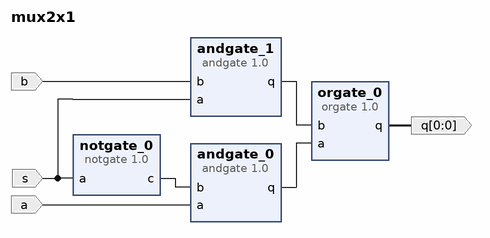
[diagram p0: block diagram of the top level]
# Vivado block design mux2x1, xc7a100tfgg484-1, Vivado 2017.4
create_bd_design mux2x1

create_bd_port -dir I s
create_bd_port -dir I a
create_bd_port -dir I b
create_bd_port -dir O -from 0 -to 0 q

create_bd_cell -type ip -vlnv CSE:CSE:notgate:1.0 notgate_0
set_property -dict {CONFIG.WIDTH 1} [get_bd_cells notgate_0]
create_bd_cell -type ip -vlnv CSE:CSE:orgate:1.0 orgate_0
set_property -dict {CONFIG.WIDTH 1} [get_bd_cells orgate_0]
create_bd_cell -type ip -vlnv CSE:CSE:andgate:1.0 andgate_0
set_property -dict {CONFIG.WIDTH 1} [get_bd_cells andgate_0]
create_bd_cell -type ip -vlnv CSE:CSE:andgate:1.0 andgate_1
set_property -dict {CONFIG.WIDTH 1} [get_bd_cells andgate_1]

# ---- connections ----

connect_bd_net [get_bd_ports s] [get_bd_pins notgate_0/a] [get_bd_pins andgate_1/a]
connect_bd_net [get_bd_pins orgate_0/q] [get_bd_ports q]
connect_bd_net [get_bd_ports a] [get_bd_pins andgate_0/a]
connect_bd_net [get_bd_pins notgate_0/c] [get_bd_pins andgate_0/b]
connect_bd_net [get_bd_ports b] [get_bd_pins andgate_1/b]
connect_bd_net [get_bd_pins andgate_0/q] [get_bd_pins orgate_0/a]
connect_bd_net [get_bd_pins andgate_1/q] [get_bd_pins orgate_0/b]

validate_bd_design
save_bd_design
